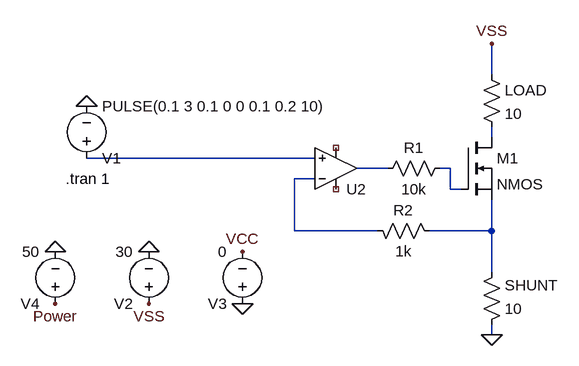
[diagram p0: schematic 6531313221-PB4.asc]
6531313221-PB4.asc, the LTspice schematic file:
Version 4
SHEET 1 880 680
WIRE 240 -176 240 -224
WIRE 240 -80 240 -96
WIRE -32 -48 -384 -48
WIRE 80 -32 32 -32
WIRE 176 -32 160 -32
WIRE -32 -16 -64 -16
WIRE 176 0 176 -32
WIRE 192 0 176 0
WIRE -64 64 -64 -16
WIRE 64 64 -64 64
WIRE 240 64 240 16
WIRE 240 64 144 64
WIRE 240 128 240 64
WIRE 240 224 240 208
FLAG -288 176 VSS
FLAG -144 96 VCC
FLAG 240 224 0
FLAG 240 -224 VSS
FLAG -384 -128 0
FLAG -288 96 0
FLAG -144 176 0
FLAG -432 176 Power
FLAG -432 96 0
SYMBOL voltage -384 -32 M180
WINDOW 123 0 0 Left 0
WINDOW 39 0 0 Left 0
SYMATTR InstName V1
SYMATTR Value PULSE(0.1 3 0.1 0 0 0.1 0.2 10)
SYMBOL voltage -288 192 R180
WINDOW 123 0 0 Left 0
WINDOW 39 0 0 Left 0
SYMATTR InstName V2
SYMATTR Value 30
SYMBOL voltage -144 192 R180
WINDOW 123 0 0 Left 0
WINDOW 39 0 0 Left 0
SYMATTR InstName V3
SYMATTR Value 0
SYMBOL res 160 80 M270
WINDOW 0 32 56 VTop 2
WINDOW 3 0 56 VBottom 2
SYMATTR InstName R2
SYMATTR Value 1k
SYMBOL res 224 224 M180
WINDOW 0 36 76 Left 2
WINDOW 3 36 40 Left 2
SYMATTR InstName SHUNT
SYMATTR Value 10
SYMBOL res 176 -48 R90
WINDOW 0 0 56 VBottom 2
WINDOW 3 32 56 VTop 2
SYMATTR InstName R1
SYMATTR Value 10k
SYMBOL res 224 -192 R0
SYMATTR InstName LOAD
SYMATTR Value 10
SYMBOL voltage -432 192 R180
WINDOW 123 0 0 Left 0
WINDOW 39 0 0 Left 0
SYMATTR InstName V4
SYMATTR Value 50
SYMBOL nmos 192 -80 R0
SYMATTR InstName M1
SYMBOL OpAmps\\UniversalOpAmp 0 -32 M180
SYMATTR InstName U2
TEXT -416 -16 Left 2 !.tran 1

The netlist it stands for:
* 6531313221-PB4.asc
V1 N002 0 PULSE(0.1 3 0.1 0 0 0.1 0.2 10)
V2 VSS 0 30
V3 0 VCC 0
R2 N006 N005 1k
R§SHUNT 0 N006 10
R1 N004 N003 10k
R§LOAD VSS N001 10
V4 Power 0 50
M1 N001 N004 N006 N006 NMOS
XU2 N002 N005 NC_01 NC_02 N003 level1 Avol=1Meg GBW=10Meg Vos=0 En=0 Enk=0 In=0 Ink=0 Rin=500Meg  ; pins In+ In- V+ V- OUT
.model NMOS NMOS
.model PMOS PMOS
.lib standard.mos
.tran 1
.lib UniversalOpAmp1.lib
.backanno
.end